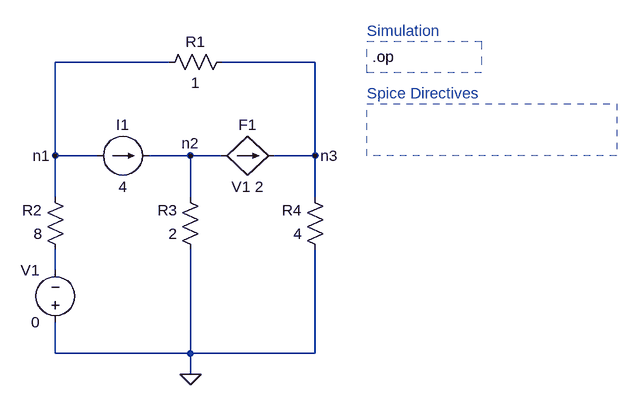
[diagram p0: schematic Example_1_CCCS_f.asc]
Example_1_CCCS_f.asc, the LTspice schematic file:
Version 4
SHEET 1 1432 696
WIRE 336 96 160 96
WIRE 560 96 416 96
WIRE 160 240 160 96
WIRE 224 240 160 240
WIRE 368 240 304 240
WIRE 416 240 368 240
WIRE 560 240 560 96
WIRE 560 240 496 240
WIRE 160 304 160 240
WIRE 368 304 368 240
WIRE 560 304 560 240
WIRE 160 416 160 384
WIRE 160 544 160 496
WIRE 368 544 368 384
WIRE 368 544 160 544
WIRE 560 544 560 384
WIRE 560 544 368 544
WIRE 368 576 368 544
FLAG 368 576 0
FLAG 160 240 n1
FLAG 368 240 n2
FLAG 560 240 n3
SYMBOL current 224 240 R270
WINDOW 0 32 40 VTop 2
WINDOW 3 -32 40 VBottom 2
SYMATTR InstName I1
SYMATTR Value 4
SYMBOL res 432 80 R90
WINDOW 0 0 56 VBottom 2
WINDOW 3 32 56 VTop 2
SYMATTR InstName R1
SYMATTR Value 1
SYMBOL res 176 400 R180
WINDOW 0 36 76 Left 2
WINDOW 3 36 40 Left 2
SYMATTR InstName R2
SYMATTR Value 8
SYMBOL res 384 400 R180
WINDOW 0 36 76 Left 2
WINDOW 3 36 40 Left 2
SYMATTR InstName R3
SYMATTR Value 2
SYMBOL res 576 400 R180
WINDOW 0 36 76 Left 2
WINDOW 3 36 40 Left 2
SYMATTR InstName R4
SYMATTR Value 4
SYMBOL f 416 240 R270
WINDOW 0 32 40 VTop 2
WINDOW 3 -32 40 VBottom 2
SYMATTR InstName F1
SYMATTR Value V1 2
SYMBOL voltage 160 512 R180
WINDOW 0 24 96 Left 2
WINDOW 3 24 16 Left 2
SYMATTR InstName V1
SYMATTR Value 0
TEXT 640 48 Left 2 ;Simulation
TEXT 648 88 Left 2 !.op
TEXT 640 144 Left 2 ;Spice Directives
RECTANGLE Normal 816 112 640 64 2
RECTANGLE Normal 1024 240 640 160 2

The netlist it stands for:
* Example_1_CCCS_f.asc
I1 n1 n2 4
R1 n3 n1 1
R2 N001 n1 8
R3 0 n2 2
R4 0 n3 4
F1 n2 n3 V1 2
V1 0 N001 0
* Simulation
.op
* Spice Directives
.backanno
.end